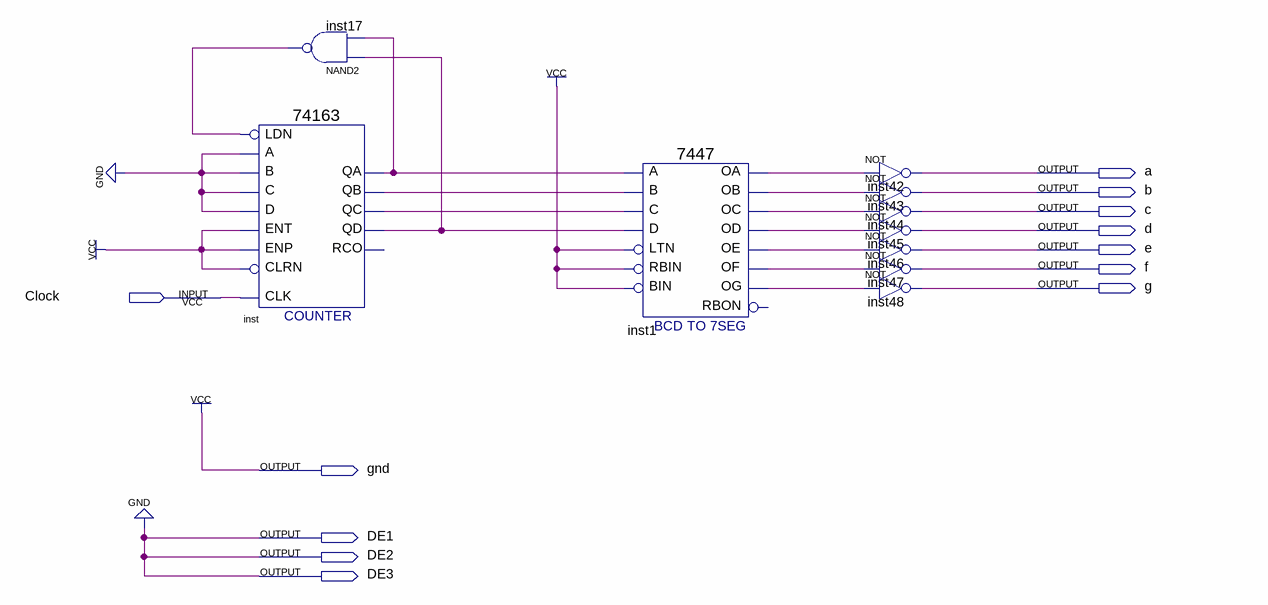
[diagram p0: schematic sheet]
// Quartus schematic bcd.bdf as structural Verilog: 10 symbols, 12 pins
module bcd (
  input  Clock,
  output a,
  output b,
  output c,
  output d,
  output e,
  output f,
  output g,
  output gnd,
  output DE1,
  output DE2,
  output DE3
);

  wire inst1_oa, inst1_ob, inst1_oc, inst1_od, inst1_oe, inst1_of, inst1_og, inst17_out, inst_qa, inst_qb,
       inst_qc, inst_qd;

  nand inst17 (inst17_out, inst_qd, inst_qa);
  \74163  inst (
    .C(1'b0), .B(1'b0), .A(1'b0), .ENT(1'b1), .D(1'b0), .CLRN(1'b1), .CLK(Clock), .ENP(1'b1),
    .LDN(inst17_out), .QA(inst_qa), .QB(inst_qb), .QC(inst_qc), .QD(inst_qd));  // open: RCO
  \7447  inst1 (
    .LTN(1'b1), .B(inst_qb), .C(inst_qc), .D(inst_qd), .RBIN(1'b1), .BIN(1'b1), .A(inst_qa), .OB(inst1_ob),
    .OC(inst1_oc), .OE(inst1_oe), .OD(inst1_od), .OF(inst1_of), .OG(inst1_og), .OA(inst1_oa));  // open: RBON
  not inst42 (a, inst1_oa);
  not inst43 (b, inst1_ob);
  not inst44 (c, inst1_oc);
  not inst45 (d, inst1_od);
  not inst46 (e, inst1_oe);
  not inst47 (f, inst1_of);
  not inst48 (g, inst1_og);

  assign DE1 = 1'b0;
  assign DE2 = 1'b0;
  assign DE3 = 1'b0;
  assign gnd = 1'b1;
endmodule
